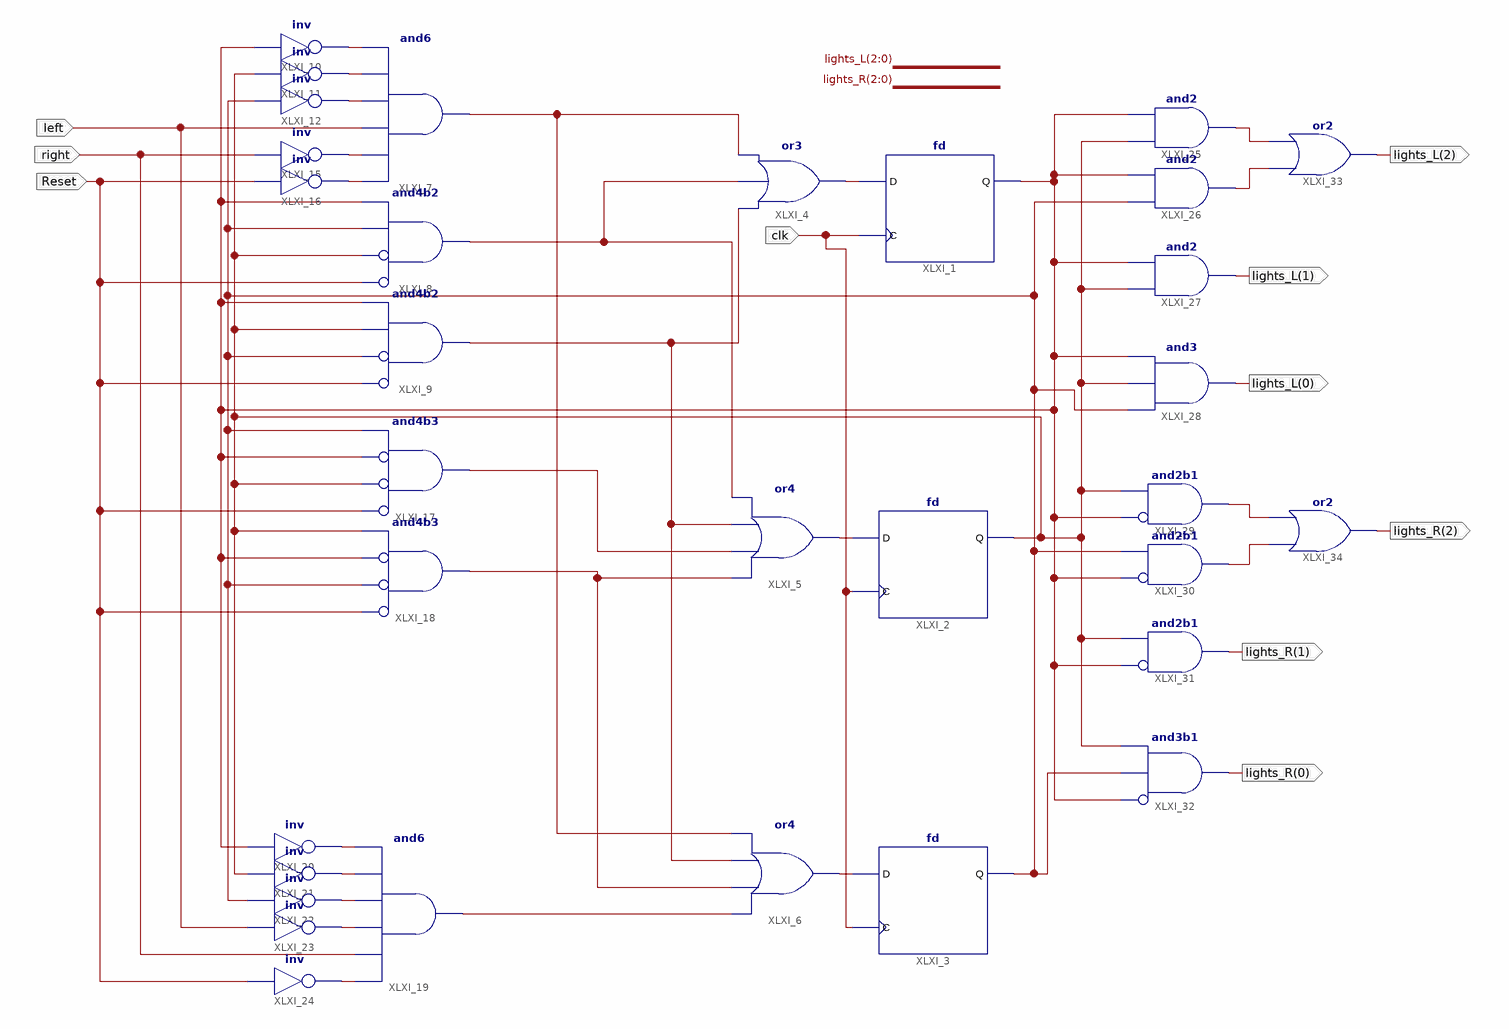
[diagram p0: schematic sheet 1]
// Xilinx ISE schematic thunderbird_fsm.sch (spartan3e) as structural Verilog: 32 symbols, 10 ports
module thunderbird_fsm (
  input  clk,
  input  Reset,
  input  left,
  input  right,
  output [2:0] lights_L,
  output [2:0] lights_R
);

  wire XLXN_1, XLXN_2, XLXN_3, XLXN_4, XLXN_5, XLXN_6, XLXN_8, XLXN_9, XLXN_12, XLXN_20, XLXN_22, XLXN_27,
       XLXN_37, XLXN_38, XLXN_40, XLXN_41, XLXN_42, XLXN_43, XLXN_44, XLXN_51, XLXN_53, XLXN_54, XLXN_55,
       XLXN_56, XLXN_59, XLXN_60;

  fd XLXI_1 (.C(clk), .D(XLXN_1), .Q(XLXN_53));
  fd XLXI_2 (.C(clk), .D(XLXN_2), .Q(XLXN_12));
  fd XLXI_3 (.C(clk), .D(XLXN_3), .Q(XLXN_54));
  or XLXI_4 (XLXN_1, XLXN_27, XLXN_22, XLXN_20);
  or XLXI_5 (XLXN_2, XLXN_38, XLXN_37, XLXN_27, XLXN_22);
  or XLXI_6 (XLXN_3, XLXN_51, XLXN_38, XLXN_27, XLXN_20);
  and XLXI_7 (XLXN_20, XLXN_9, XLXN_8, left, XLXN_6, XLXN_5, XLXN_4);
  and XLXI_8 (XLXN_22, ~Reset, ~XLXN_12, XLXN_54, XLXN_53);  // and4b2
  and XLXI_9 (XLXN_27, ~Reset, ~XLXN_54, XLXN_12, XLXN_53);  // and4b2
  not XLXI_10 (XLXN_4, XLXN_53);
  not XLXI_11 (XLXN_5, XLXN_12);
  not XLXI_12 (XLXN_6, XLXN_54);
  not XLXI_15 (XLXN_8, right);
  not XLXI_16 (XLXN_9, Reset);
  and XLXI_17 (XLXN_37, ~Reset, ~XLXN_12, ~XLXN_53, XLXN_54);  // and4b3
  and XLXI_18 (XLXN_38, ~Reset, ~XLXN_54, ~XLXN_53, XLXN_12);  // and4b3
  and XLXI_19 (XLXN_51, XLXN_44, right, XLXN_43, XLXN_42, XLXN_41, XLXN_40);
  not XLXI_20 (XLXN_40, XLXN_53);
  not XLXI_21 (XLXN_41, XLXN_12);
  not XLXI_22 (XLXN_42, XLXN_54);
  not XLXI_23 (XLXN_43, left);
  not XLXI_24 (XLXN_44, Reset);
  and XLXI_25 (XLXN_56, XLXN_12, XLXN_53);
  and XLXI_26 (XLXN_55, XLXN_54, XLXN_53);
  and XLXI_27 (lights_L[1], XLXN_12, XLXN_53);
  and XLXI_28 (lights_L[0], XLXN_54, XLXN_12, XLXN_53);
  and XLXI_29 (XLXN_60, ~XLXN_53, XLXN_12);  // and2b1
  and XLXI_30 (XLXN_59, ~XLXN_53, XLXN_54);  // and2b1
  and XLXI_31 (lights_R[1], ~XLXN_53, XLXN_12);  // and2b1
  and XLXI_32 (lights_R[0], ~XLXN_53, XLXN_54, XLXN_12);  // and3b1
  or XLXI_33 (lights_L[2], XLXN_55, XLXN_56);
  or XLXI_34 (lights_R[2], XLXN_59, XLXN_60);
endmodule
